# EasyEDA schematic SCH_SIT210 10.1D_2022-05-21.json
TITLE: SIT210 10.1D; REV: 1.0; Date: 2022-05-21; Sheet: 1/1; Company: Deakin University
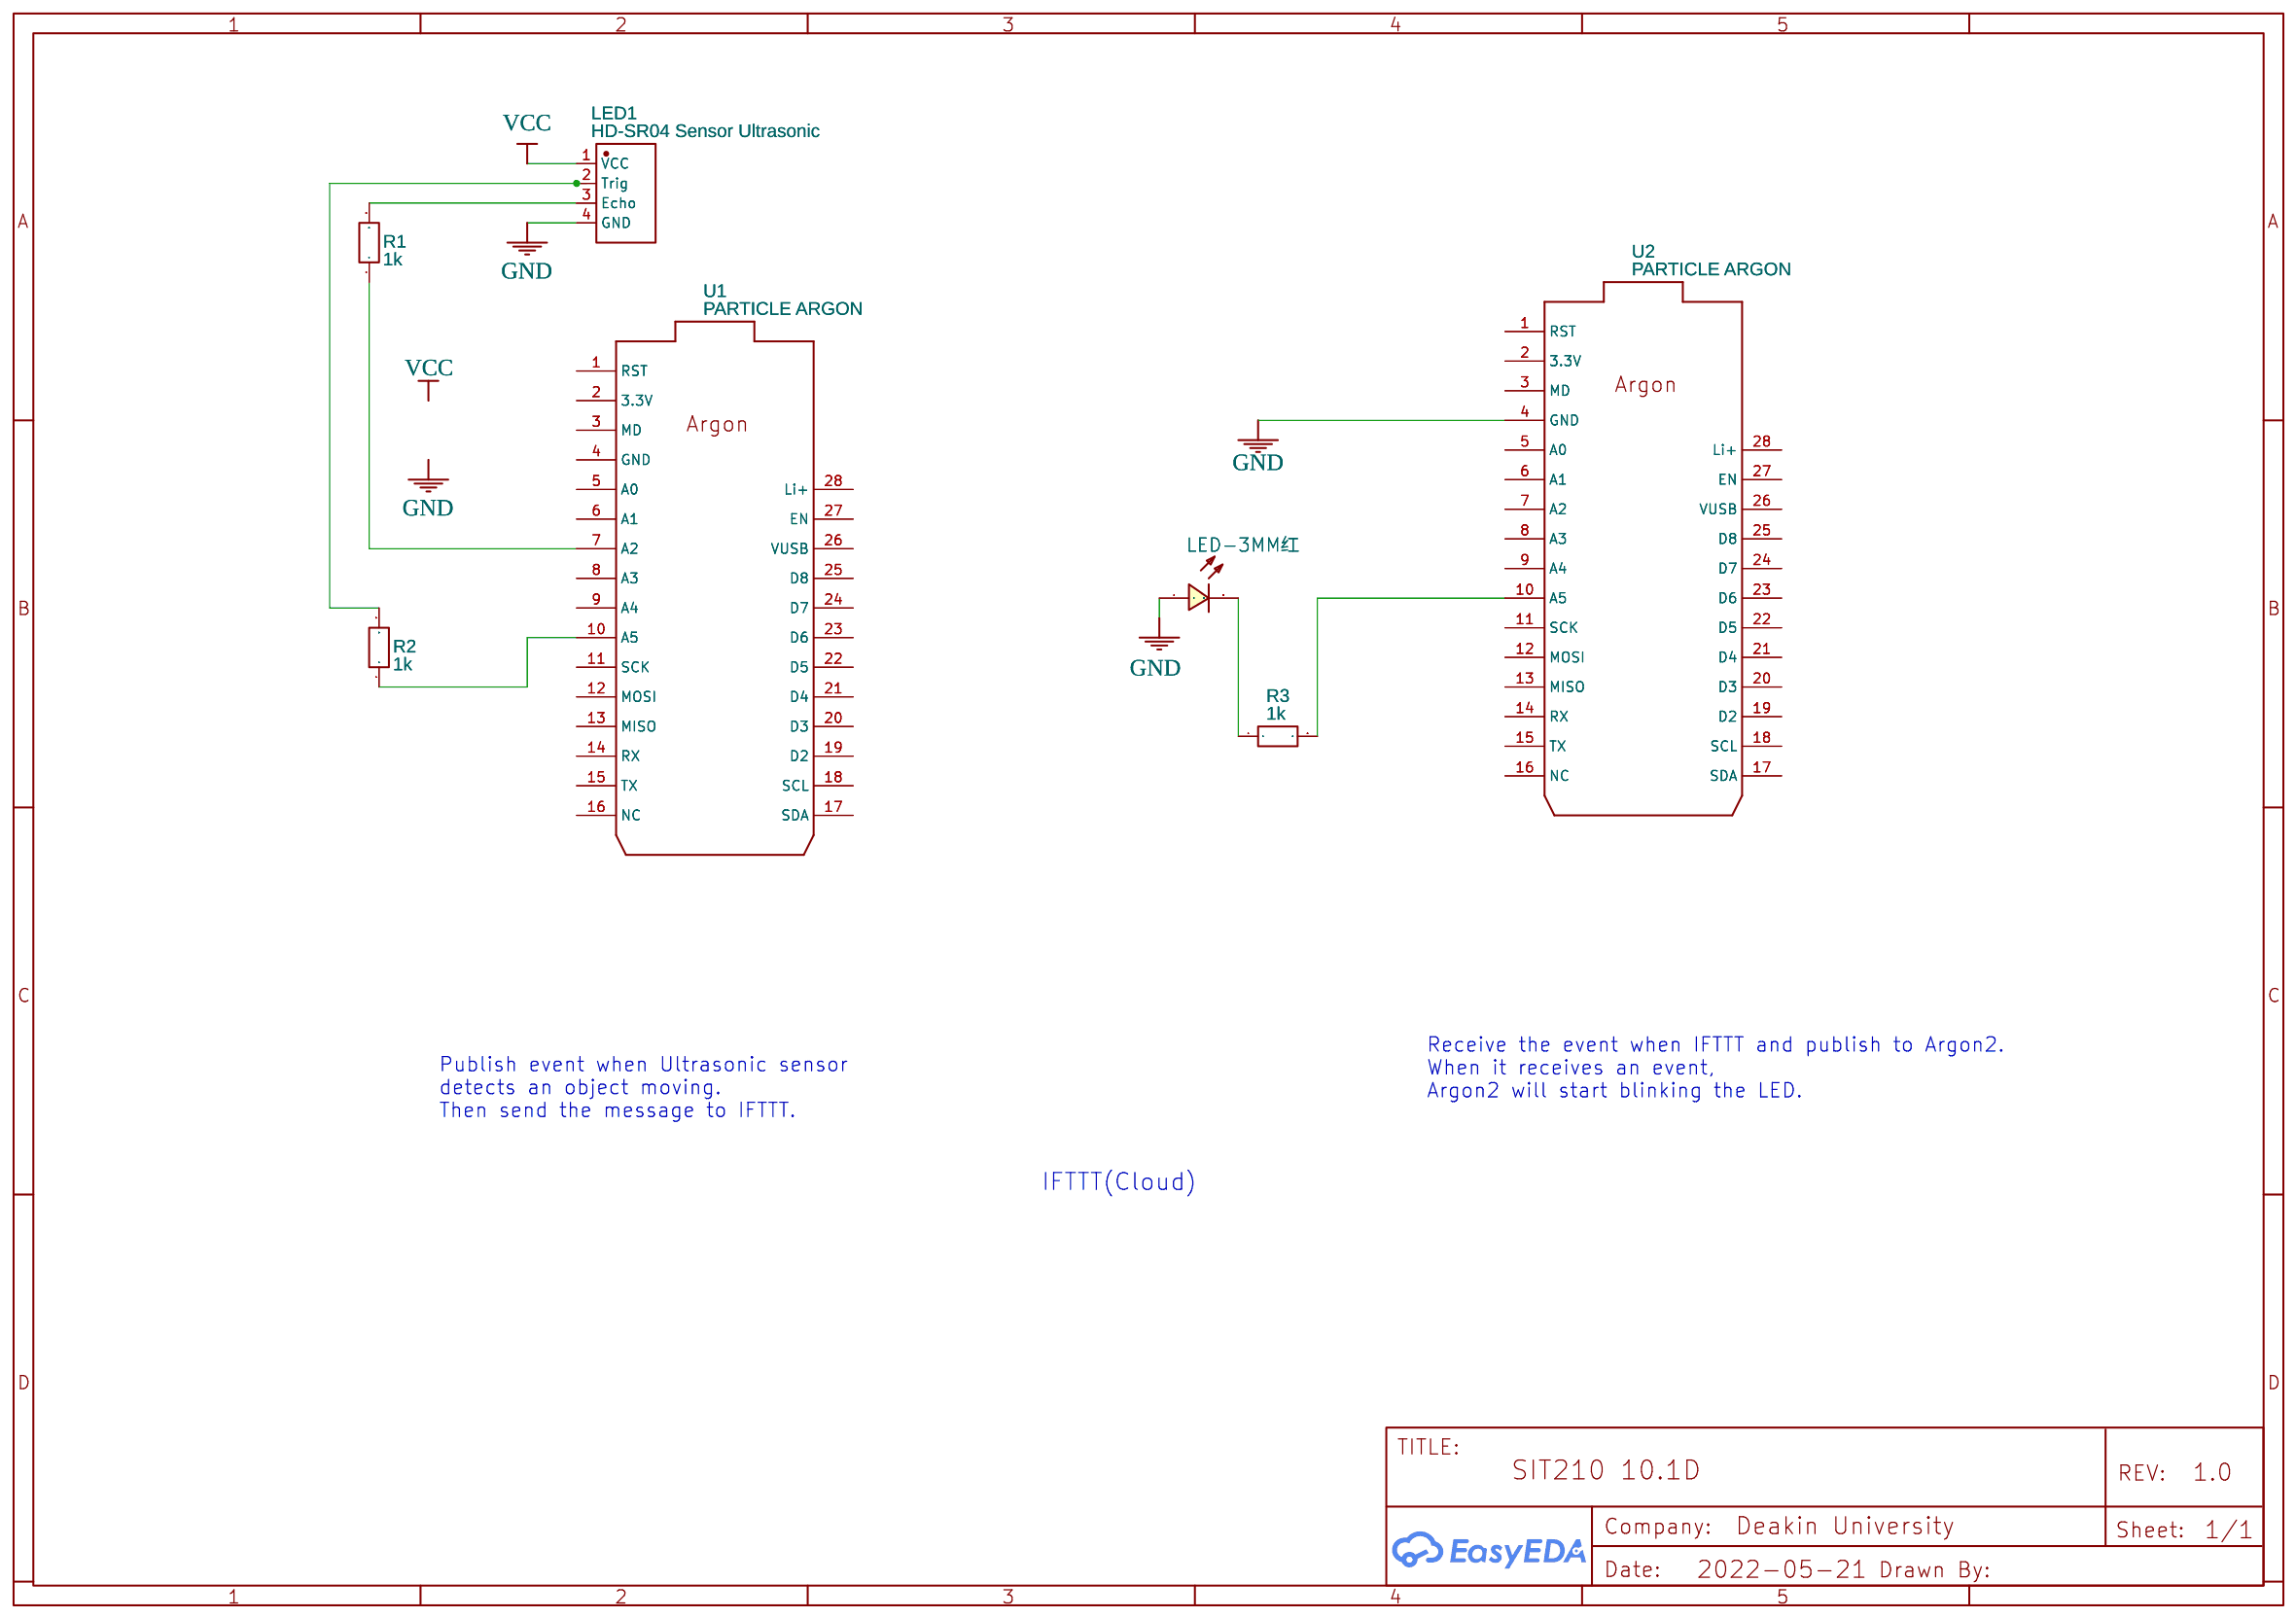
[diagram p0: schematic sheet]

## Parts
LED1  HD-SR04 Sensor Ultrasonic  [SENSOR-SMD_TSOP75336TT]
NO  LED-3MM红  [LED-TH_LED-3MM_RED]
R1  1k  [R0603]
R2  1k  [R0603]
R3  1k  [R0603]
U1  PARTICLE ARGON  [PARTICLE ARGON]
U2  PARTICLE ARGON  [PARTICLE ARGON]

## Library data of the parts
LED1 = HD-SR04 Sensor Ultrasonic: Supplier: LCSC; Supplier Part: C499577; Manufacturer: Vishay Intertech; Manufacturer Part: TSOP75336TT; Contributor: sraopv
NO = LED-3MM红: Supplier: LCSC; Supplier Part: C9900003389; Manufacturer Part: LED-3mm红; link: https://img.jlc.com/pdf/applyPasteComponent/2021-12-06/748033A/127ffe71aa84443fa05d6ffed81d0b6e/LED-3mm.pdf; Contributor: LCSC; JLCPCB Part Class: Extended Part
R1-R3 = R_0603_EU: Contributor: LCEDA_Lib
U1 U2 = PARTICLE ARGON: Manufacturer: Particle; Manufacturer Part: Particle Argon; Supplier Part: Particle Argon; Supplier: Particle; Contributor: stevecoster

## Nets
GND: LED1.4(GND) NO.1 U2.4(GND)
VCC: LED1.1(VCC)
Net-(LED1-2): LED1.2(Trig) R2.2
Net-(LED1-3): LED1.3(Echo) R1.2
Net-(NO-2): NO.2 R3.1
Net-(R1-1): R1.1 U1.7(A2)
Net-(R2-1): R2.1 U1.10(A5)
Net-(R3-2): R3.2 U2.10(A5)

Not connected (* = marked no-connect by the designer): U1 1(RST) 2(3.3V) 3(MD) 4(GND) 5(A0) 6(A1) 8(A3) 9(A4) 11(SCK) 12(MOSI) 13(MISO) 14(RX) 15(TX) 16(NC) 17(SDA) 18(SCL) 19(D2) 20(D3) 21(D4) 22(D5) 23(D6) 24(D7) 25(D8) 26(VUSB) 27(EN) 28(Li+); U2 1(RST) 2(3.3V) 3(MD) 5(A0) 6(A1) 7(A2) 8(A3) 9(A4) 11(SCK) 12(MOSI) 13(MISO) 14(RX) 15(TX) 16(NC) 17(SDA) 18(SCL) 19(D2) 20(D3) 21(D4) 22(D5) 23(D6) 24(D7) 25(D8) 26(VUSB) 27(EN) 28(Li+)

## Notes on the sheet
- Receive the event when IFTTT and publish to Argon2.
  When it receives an event,
  Argon2 will start blinking the LED.
- Publish event when Ultrasonic sensor
  detects an object moving.
  Then send the message to IFTTT.
- IFTTT(Cloud)
